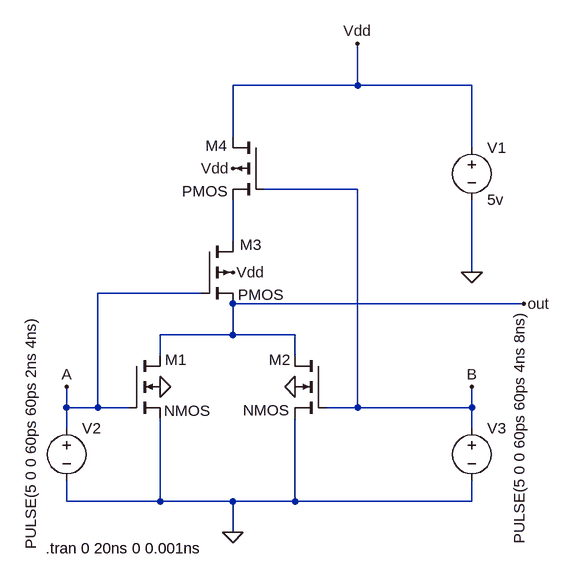
[diagram p0: schematic NOR.asc]
NOR.asc, the LTspice schematic file:
Version 4
SHEET 1 964 680
WIRE 384 -320 384 -384
WIRE 384 -320 192 -320
WIRE 560 -320 384 -320
WIRE 192 -240 192 -320
WIRE 560 -224 560 -320
WIRE 384 -160 240 -160
WIRE 192 -80 192 -144
WIRE 560 -32 560 -144
WIRE 144 0 -16 0
WIRE 640 16 192 16
WIRE 192 64 192 16
WIRE 192 64 80 64
WIRE 288 64 192 64
WIRE 80 96 80 64
WIRE 288 96 288 64
WIRE -64 176 -64 144
WIRE -16 176 -16 0
WIRE -16 176 -64 176
WIRE 32 176 -16 176
WIRE 384 176 384 -160
WIRE 384 176 336 176
WIRE 560 176 560 144
WIRE 560 176 384 176
WIRE -64 208 -64 176
WIRE 560 208 560 176
WIRE -64 320 -64 288
WIRE 80 320 80 192
WIRE 80 320 -64 320
WIRE 192 320 80 320
WIRE 288 320 288 192
WIRE 288 320 192 320
WIRE 560 320 560 288
WIRE 560 320 288 320
WIRE 192 368 192 320
FLAG 192 368 0
FLAG 560 -32 0
FLAG 384 -384 Vdd
FLAG 192 -192 Vdd
FLAG 192 -32 Vdd
FLAG 80 144 0
FLAG 288 144 0
FLAG 640 16 out
FLAG -64 144 A
FLAG 560 144 B
SYMBOL nmos4 32 96 R0
WINDOW 0 56 6 Left 2
WINDOW 3 54 85 Left 2
SYMATTR InstName M1
SYMATTR Value2 l=0.6u w=3u
SYMBOL nmos4 336 96 M0
WINDOW 0 55 6 Left 2
WINDOW 3 56 84 Left 2
SYMATTR InstName M2
SYMATTR Value2 l=0.6u w=3u
SYMBOL pmos4 144 -80 R0
WINDOW 0 59 5 Left 2
WINDOW 3 56 82 Left 2
SYMATTR InstName M3
SYMATTR Value2 l=0.6u w=6u
SYMBOL pmos4 240 -240 M0
WINDOW 0 56 13 Left 2
WINDOW 3 56 83 Left 2
SYMATTR InstName M4
SYMATTR Value2 l=0.6u w=6u
SYMBOL voltage 560 -240 R0
WINDOW 123 0 0 Left 0
WINDOW 39 0 0 Left 0
SYMATTR InstName V1
SYMATTR Value 5v
SYMBOL voltage -64 192 R0
WINDOW 3 -55 -157 VRight 2
WINDOW 123 0 0 Left 0
WINDOW 39 0 0 Left 0
SYMATTR Value PULSE(5 0 0 60ps 60ps 2ns 4ns)
SYMATTR InstName V2
SYMBOL voltage 560 192 R0
WINDOW 3 73 -165 VRight 2
WINDOW 123 0 0 Left 0
WINDOW 39 0 0 Left 0
SYMATTR Value PULSE(5 0 0 60ps 60ps 4ns 8ns)
SYMATTR InstName V3
TEXT -96 392 Left 2 !.tran 0 20ns 0 0.001ns

The netlist it stands for:
* NOR.asc
M1 out A 0 0 NMOS l=0.6u w=3u
M2 out B 0 0 NMOS l=0.6u w=3u
M3 N001 A out Vdd PMOS l=0.6u w=6u
M4 Vdd B N001 Vdd PMOS l=0.6u w=6u
V1 Vdd 0 5v
V2 A 0 PULSE(5 0 0 60ps 60ps 2ns 4ns)
V3 B 0 PULSE(5 0 0 60ps 60ps 4ns 8ns)
.model NMOS NMOS
.model PMOS PMOS
.lib standard.mos
.tran 0 20ns 0 0.001ns
.backanno
.end